# EAGLE design MurataMicroMB (EAGLE 7.5.0)
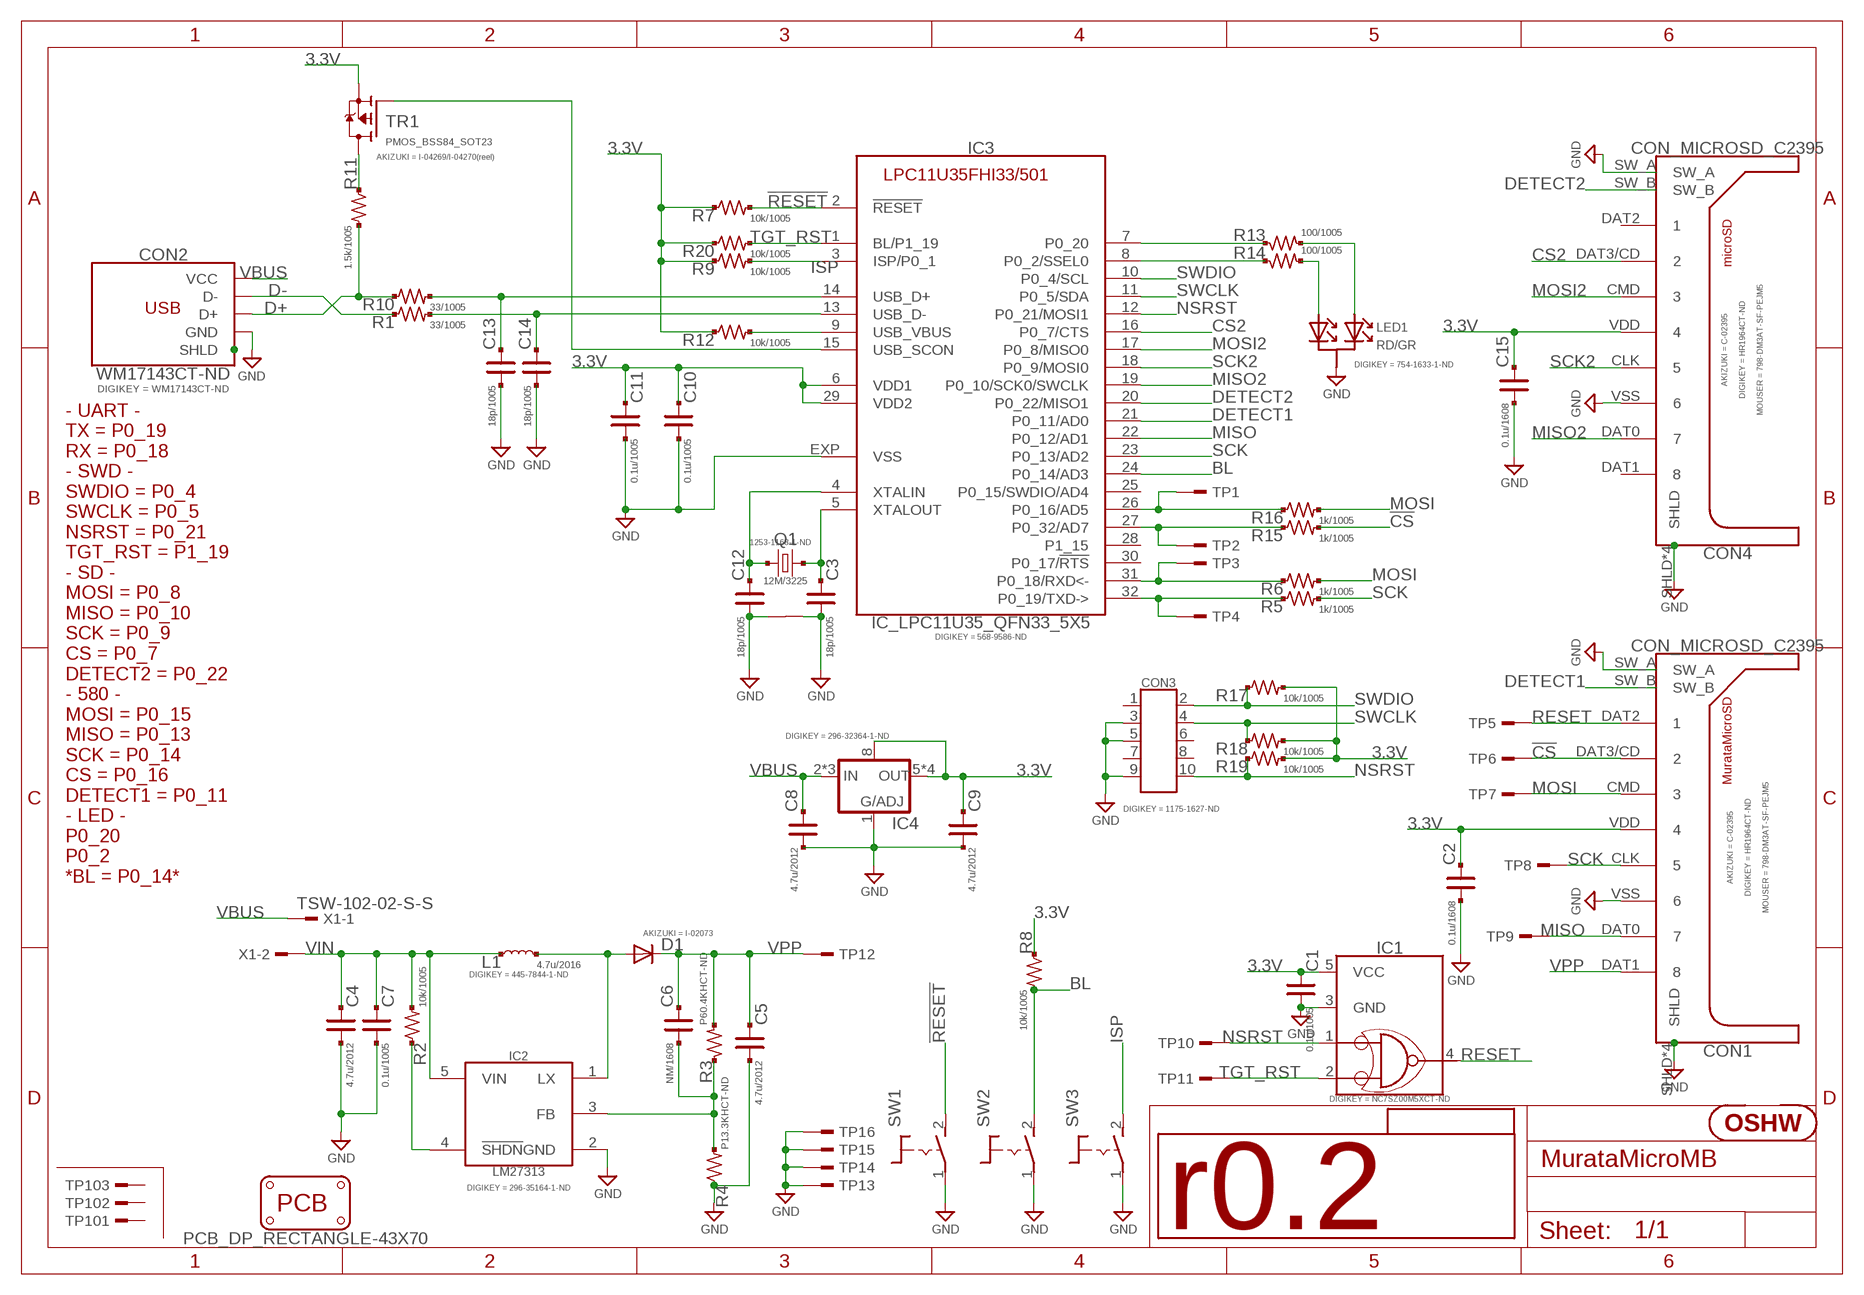
[diagram p0: schematic, sheet 1]

## Parts
C1  0.1u/1005  C_SMD_0.1U_1005  [C0402]
C2  0.1u/1608  C_SMD_0.1U_1608  [CR_1608]
C3  18p/1005  C_SMD_18P_1005  [C0402]
C4  4.7u/2012  C_SMD_4.7U_2012  [CR_2125]
C5  4.7u/2012  C_SMD_4.7U_2012  [CR_2125]
C6  NM/1608  C_SMD__1608  [CR_1608]
C7  0.1u/1005  C_SMD_0.1U_1005  [C0402]
C8  4.7u/2012  C_SMD_4.7U_2012  [CR_2125]
C9  4.7u/2012  C_SMD_4.7U_2012  [CR_2125]
C10  0.1u/1005  C_SMD_0.1U_1005  [C0402]
C11  0.1u/1005  C_SMD_0.1U_1005  [C0402]
C12  18p/1005  C_SMD_18P_1005  [C0402]
C13  18p/1005  C_SMD_18P_1005  [C0402]
C14  18p/1005  C_SMD_18P_1005  [C0402]
C15  0.1u/1608  C_SMD_0.1U_1608  [CR_1608]
CON1  CON_MICROSD_C2395  [CON_MICROSD_C2395]
CON2  WM17143CT-ND  CON_USB_UB  [CON_USB_47589-0001MOLEX]
CON3  CON_MIL_10_ARM  [CON_CORESIGHT10_1175-1627-ND]
CON4  CON_MICROSD_C2395  [CON_MICROSD_C2395]
D1  40V2A  DIODE2_40V2A_SOD123  [DIODE_2125]
GIT1  GIT-REVISION  [GIT-REVISION]
IC1  IC_TTL_SINGLE_74_00_SOT23  [SOT95P280X145-5N]
IC2  LM27313  IC_DCDC_LM27313_SOT23  [SOT95P280X145-5N]
IC3  IC_LPC11U35_QFN33_5X5  [HVQFN33]
IC4  LDO4_3.3_DRJ  [DFN80P410X410_8N]
ICON1  r0.2  ICON_REVISION_2.0  [ICON_REVISION2.0]
L1  4.7u/2016  INDUCTOR_4.7U_2016  [L_2016]
LED1  RD/GR  LED2_A2K1_GR/RD  [SOT105P300X130-3N]
PCB1  PCB_DP_RECTANGLE-43X70  [DP7043_V1]
Q1  12M/3225  CRYSTAL4_12M_3225  [CLOCK_3225]
R1  33/1005  R_US_33R_1005  [C0402]
R2  10k/1005  R_US_10K_1005  [C0402]
R3  P60.4KHCT-ND  R_US_60.4K_1608  [R_1608_PADPAD]
R4  P13.3KHCT-ND  R_US_13.3K_1608  [R_1608_PADPAD]
R5  1k/1005  R_US_1.0K_1005  [C0402]
R6  1k/1005  R_US_1.0K_1005  [C0402]
R7  10k/1005  R_US_10K_1005  [C0402]
R8  10k/1005  R_US_10K_1005  [C0402]
R9  10k/1005  R_US_10K_1005  [C0402]
R10  33/1005  R_US_33R_1005  [C0402]
R11  1.5k/1005  R_US_1.5K_1005  [C0402]
R12  10k/1005  R_US_10K_1005  [C0402]
R13  100/1005  R_US_100R_1005  [C0402]
R14  100/1005  R_US_100R_1005  [C0402]
R15  1k/1005  R_US_1.0K_1005  [C0402]
R16  1k/1005  R_US_1.0K_1005  [C0402]
R17  10k/1005  R_US_10K_1005  [C0402]
R18  10k/1005  R_US_10K_1005  [C0402]
R19  10k/1005  R_US_10K_1005  [C0402]
R20  10k/1005  R_US_10K_1005  [C0402]
SW1  TACTSW2_FSM2JMTR  [SW_TACTSW_FSM2JMTR]
SW2  TACTSW2_FSM2JMTR  [SW_TACTSW_FSM2JMTR]
SW3  TACTSW2_FSM2JMTR  [SW_TACTSW_FSM2JMTR]
TP1  TESTPAD_1608  [TP_1608]
TP2  TESTPAD_1608  [TP_1608]
TP3  TESTPAD_1608  [TP_1608]
TP4  TESTPAD_1608  [TP_1608]
TP5  TESTPAD  [TP06RECT]
TP6  TESTPAD  [TP06RECT]
TP7  TESTPAD  [TP06RECT]
TP8  TESTPAD  [TP06RECT]
TP9  TESTPAD  [TP06RECT]
TP10  TESTPAD  [TP06RECT]
TP11  TESTPAD  [TP06RECT]
TP12  TESTPAD  [TP06RECT]
TP13  TESTPAD_4020  [TP_4020]
TP14  TESTPAD_4020  [TP_4020]
TP15  TESTPAD_4020  [TP_4020]
TP16  TESTPAD_4020  [TP_4020]
TP101  TESTPAD_F  [FIDUCIAL]
TP102  TESTPAD_F  [FIDUCIAL]
TP103  TESTPAD_F  [FIDUCIAL]
TR1  PMOS_BSS84_SOT23  [SOT95P300X140-3N]
U$1  ICON_OSHW  [ICON_OSHW]
X1  TSW-102-02-S-S  [TSW-102-02-S-S]

## Nets
3.3V: C1.1 C2.1 C9.1 C10.1 C11.1 C15.1 CON1.VDD CON4.VDD IC1.5(VCC) IC3.6(VDD1) IC3.29(VDD2) IC4.5(OUT) IC4.6(OUT) IC4.7(OUT) IC4.8(OUT/EN/NC) IC4.EP(OUT) R7.1 R8.1 R9.1 R12.1 R17.2 R18.2 R19.2 R20.1 TR1.2(S)
!CS!: CON1.DAT3/CD R15.2 TP6.TP
!RESET!: IC3.2(!RESET!) R7.2 SW1.2(S)
BL: IC3.24(P0_14/AD3) R8.2 SW2.2(S)
CS2: CON4.DAT3/CD IC3.16(P0_7/CTS)
D+: CON2.3(D+) R10.1 R11.2
D-: CON2.2(D-) R1.1
DETECT1: CON1.SW_B IC3.21(P0_11/AD0)
DETECT2: CON4.SW_B IC3.20(P0_22/MISO1)
GND: C1.2 C2.2 C3.2 C4.2 C5.2 C7.2 C8.2 C9.2 C10.2 C11.2 C12.2 C13.2 C14.2 C15.2 CON1.SHLD CON1.SHLD@2(SHLD) CON1.SHLD@3(SHLD) CON1.SHLD@4(SHLD) CON1.SW_A CON1.VSS CON2.5(GND) CON3.3 CON3.5 CON3.9 CON4.SHLD CON4.SHLD@2(SHLD) CON4.SHLD@3(SHLD) CON4.SHLD@4(SHLD) CON4.SW_A CON4.VSS IC1.3(GND) IC2.2(GND) IC3.EXP(VSS) IC4.1(ADJ) LED1.3(K1) Q1.2 Q1.4 R4.1 SW1.1(P) SW2.1(P) SW3.1(P) TP13.TP TP14.TP TP15.TP TP16.TP
ISP: IC3.3(ISP/P0_1) R9.2 SW3.2(S)
MISO: CON1.DAT0 IC3.22(P0_12/AD1) TP9.TP
MISO2: CON4.DAT0 IC3.19(P0_10/SCK0/SWCLK)
MOSI: CON1.CMD R6.2 R16.2 TP7.TP
MOSI2: CON4.CMD IC3.17(P0_8/MISO0)
N$1: IC3.8(P0_2/SSEL0) R14.1
N$2: R11.1 TR1.3(D)
N$4: CON2.SHD$1(SHLD) CON2.SHD$2(SHLD) CON2.SHD$3(SHLD) CON2.SHD$4(SHLD) CON2.SHD$5(SHLD) CON2.SHD$6(SHLD) CON2.SHD$7(SHLD) CON2.SHD(SHLD)
N$5: C12.1 IC3.4(XTALIN) Q1.1
N$6: IC3.31(P0_18/RXD<-) R6.1 TP3.TP
N$7: D1.A IC2.1(LX) L1.2
N$8: IC2.4(!SHDN!) R2.1
N$9: IC3.32(P0_19/TXD->) R5.1 TP4.TP
N$10: C6.2 IC2.3(FB) R3.1 R4.2
N$11: C3.1 IC3.5(XTALOUT) Q1.3
N$12: IC3.15(USB_SCON) TR1.1(G)
N$13: IC3.9(USB_VBUS) R12.2
N$14: IC3.7(P0_20) R13.1
N$15: LED1.2(A2) R13.2
N$16: LED1.1(A1) R14.2
N$17: IC3.26(P0_16/AD5) R16.1 TP1.TP
N$18: IC3.27(P0_32/AD7) R15.1 TP2.TP
N$20: C13.1 IC3.14(USB_D+) R10.2
N$24: C14.1 IC3.13(USB_D-) R1.2
NSRST: CON3.10 IC1.1(1A) IC3.12(P0_21/MOSI1) R19.1 TP10.TP
RESET: CON1.DAT2 IC1.4(1Y) TP5.TP
SCK: CON1.CLK IC3.23(P0_13/AD2) R5.2 TP8.TP
SCK2: CON4.CLK IC3.18(P0_9/MOSI0)
SWCLK: CON3.4 IC3.11(P0_5/SDA) R18.1
SWDIO: CON3.2 IC3.10(P0_4/SCL) R17.1
TGT_RST: IC1.2(1B) IC3.1(BL/P1_19) R20.2 TP11.TP
VBUS: C8.1 CON2.1(VCC) IC4.2(IN) IC4.3(IN) IC4.4(IN) X1.1
VIN: C4.1 C7.1 IC2.5(VIN) L1.1 R2.2 X1.2
VPP: C5.1 C6.1 CON1.DAT1 D1.K(C) R3.2 TP12.TP
Unconnected: CON3.1 CON3.6 CON3.7 CON3.8 CON4.DAT1 CON4.DAT2 IC3.25(P0_15/SWDIO/AD4) IC3.28(P1_15) IC3.30(P0_17/!RTS!) TP101.TP TP102.TP TP103.TP

## Notes on the sheet
- microSD
- MurataMicroSD
- - UART -
  TX = P0_19
  RX = P0_18
  - SWD -
  SWDIO = P0_4
  SWCLK = P0_5
  NSRST = P0_21
  TGT_RST = P1_19
  - SD -
  MOSI = P0_8
  MISO = P0_10
  SCK = P0_9
  CS = P0_7
  DETECT2 = P0_22
  - 580 -
  MOSI = P0_15
  MISO = P0_13
  SCK = P0_14
  CS = P0_16
  DETECT1 = P0_11
  - LED -
  P0_20
  P0_2
  *BL = P0_14*

## Library data of the parts
C1 C7 C10 C11 = mylib:C_SMD_*: SMD CAPACITOR; DIGIKEY: 490-3261-1-ND; SEEED: 302010024
C2 C15 = mylib:C_SMD_*: SMD CAPACITOR; AKIZUKI: P-05650
C3 C12-C14 = mylib:C_SMD_*: SMD CAPACITOR; DIGIKEY: 490-5858-1-ND; SEEED: 302010016
C4 C5 C8 C9 = mylib:C_SMD_*: SMD CAPACITOR; DIGIKEY: 490-9962-1-ND
C6 = mylib:C_SMD_*: SMD CAPACITOR; NOT_COMPONENT: YES
CON1 CON4 = mylib:CON_MICROSD: HIROSE DM3AT-SF-PEJM5 798-DM3AT-SF-PEJM5(Mouser) http://www.mouser.jp/ProductDetail/Hirose-Connector/DM3AT-SF-PEJM5/?qs=LZSZKJVF%252b2WTDKp%252bR7IYAQ%3d%3d&_cdc=0; AKIZUKI: C-02395; DIGIKEY: HR1964CT-ND; MOUSER: 798-DM3AT-SF-PEJM5
CON2 = mylib:CON_USB: USB B CONNECTOR; DIGIKEY: WM17143CT-ND
CON3 = mylib:CON_MIL_10: MIL Box Pinheader : 10Pin; DIGIKEY: 1175-1627-ND
D1 = mylib:DIODE2_*: DIODE high speed (Philips); AKIZUKI: I-02073; DIGIKEY: SS24FLCT-ND
GIT1 = git-revision:GIT-REVISION; NOT_COMPONENT: YES
IC1 = mylib:IC_TTL_SINGLE_74_00: SINGLE 2-INPUT POSITIVE-OR GATE; DIGIKEY: NC7SZ00M5XCT-ND
IC2 = mylib:IC_DCDC_LM27313; DIGIKEY: 296-35164-1-ND
IC3 = mylib:IC_LPC11U*_QFN33; DIGIKEY: 568-9586-ND; SEEED: 310010053
IC4 = mylib:LDO4_*: LDO with 4 pins; DIGIKEY: 296-32364-1-ND
ICON1 = mylib:ICON_REVISION; NOT_COMPONENT: YES
L1 = mylib:INDUCTOR_; DIGIKEY: 445-7844-1-ND
LED1 = mylib:LED2_A2K1_*; DIGIKEY: 754-1633-1-ND
PCB1 = dp_pcb_local:PCB_DP_RECTANGLE: Dangerous Prototypes Standard Rectangular PCB sizes; NOT_COMPONENT: YES
Q1 = mylib:CRYSTAL4_*: Crystal 4 pins; DIGIKEY: 1253-1168-1-ND
R1 R10 = mylib:R_US_*: SMD resistor Packages : _1608 : 1.6 x 0.8 mm _2125 : 2.0 x 1.25 mm _3216 : 3.2 x 1.6 mm; DIGIKEY: P33.0LCT-ND; SEEED: 301010609
R2 R7-R9 R12 R17-R20 = mylib:R_US_*: SMD resistor Packages : _1608 : 1.6 x 0.8 mm _2125 : 2.0 x 1.25 mm _3216 : 3.2 x 1.6 mm; DIGIKEY: P10.0KLCT-ND; SEEED: 301010047
R3 = mylib:R_US_*: SMD resistor Packages : _1608 : 1.6 x 0.8 mm _2125 : 2.0 x 1.25 mm _3216 : 3.2 x 1.6 mm; DIGIKEY: P60.4KHCT-ND
R4 = mylib:R_US_*: SMD resistor Packages : _1608 : 1.6 x 0.8 mm _2125 : 2.0 x 1.25 mm _3216 : 3.2 x 1.6 mm; DIGIKEY: P13.3KHCT-ND
R5 R6 R15 R16 = mylib:R_US_*: SMD resistor Packages : _1608 : 1.6 x 0.8 mm _2125 : 2.0 x 1.25 mm _3216 : 3.2 x 1.6 mm; DIGIKEY: P1.00KLCT-ND; SEEED: 301010006
R11 = mylib:R_US_*: SMD resistor Packages : _1608 : 1.6 x 0.8 mm _2125 : 2.0 x 1.25 mm _3216 : 3.2 x 1.6 mm; DIGIKEY: P1.50KLCT-ND; SEEED: 301010001
R13 R14 = mylib:R_US_*: SMD resistor Packages : _1608 : 1.6 x 0.8 mm _2125 : 2.0 x 1.25 mm _3216 : 3.2 x 1.6 mm; DIGIKEY: P100LCT-ND; SEEED: 301010028
SW1-SW3 = mylib:TACTSW2_*: 2P tact switch; DIGIKEY: 450-2146-1-ND
TP1-TP4 = mylib:TESTPAD: test points; DIGIKEY: A106145CT-ND
TP5-TP12 TP101-TP103 = mylib:TESTPAD: test points; NOT_COMPONENT: YES
TP13-TP16 = mylib:TESTPAD: test points; DIGIKEY: 36-5019CT-ND
TR1 = mylib:PMOS_*; AKIZUKI: I-04269/I-04270(reel); DIGIKEY: BSS84CT-ND
U$1 = mylib:ICON_OSHW: Silk icon of OSHW; NOT_COMPONENT: YES
X1 = con-samtec.local:TSW-102-02-S-S: THROUGH-HOLE POST HEADER Source: Samtec TSW.pdf; DIGIKEY: S1011EC-02-ND; SEEED: 320020016

## Board
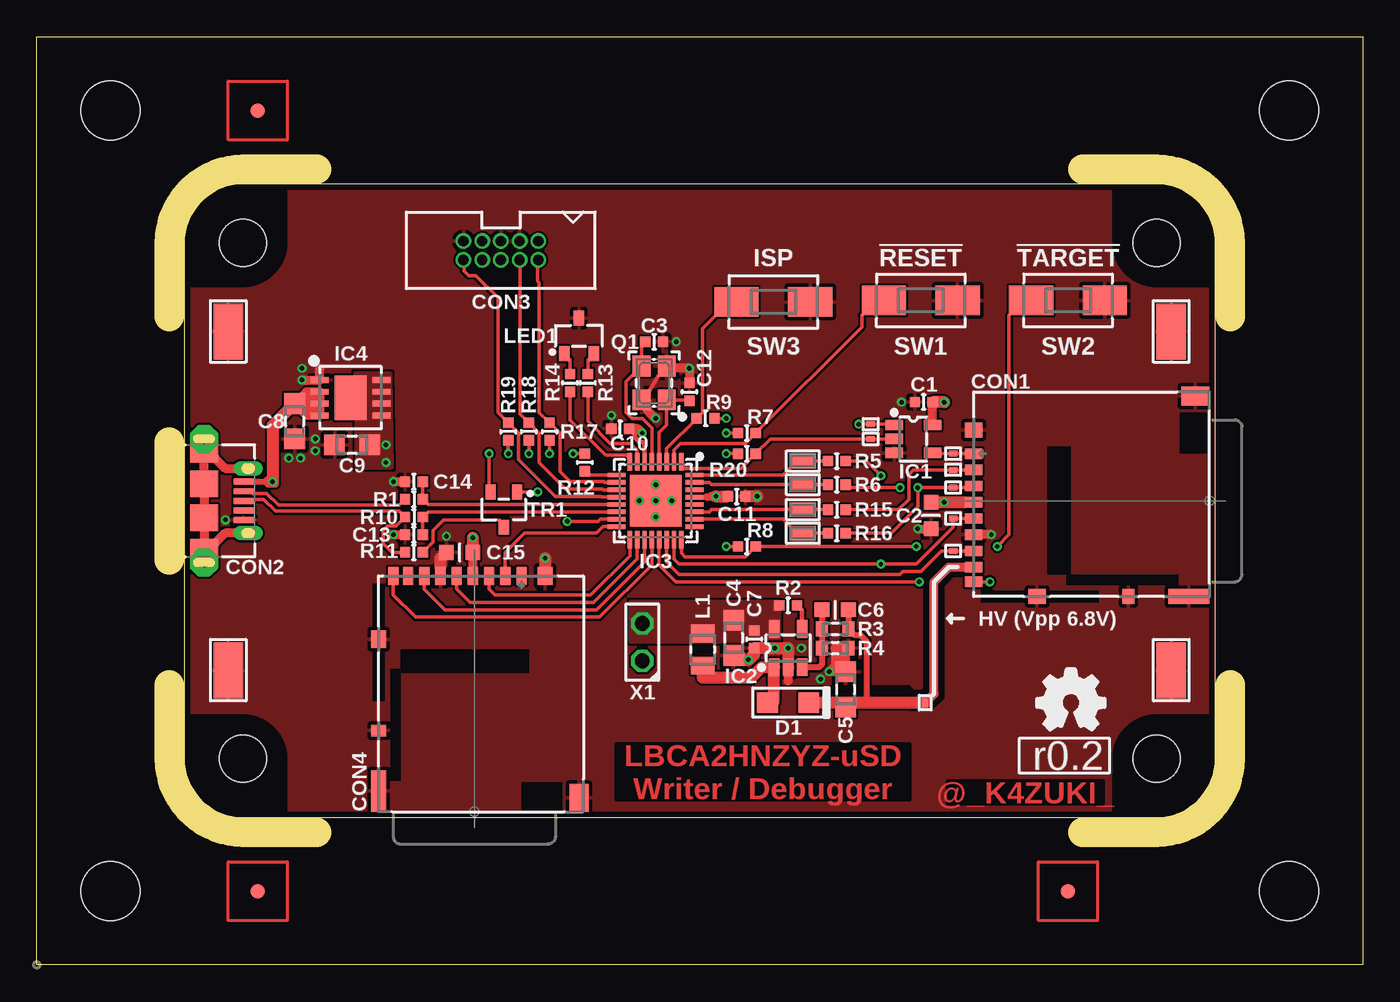
[diagram p1: board, top side]
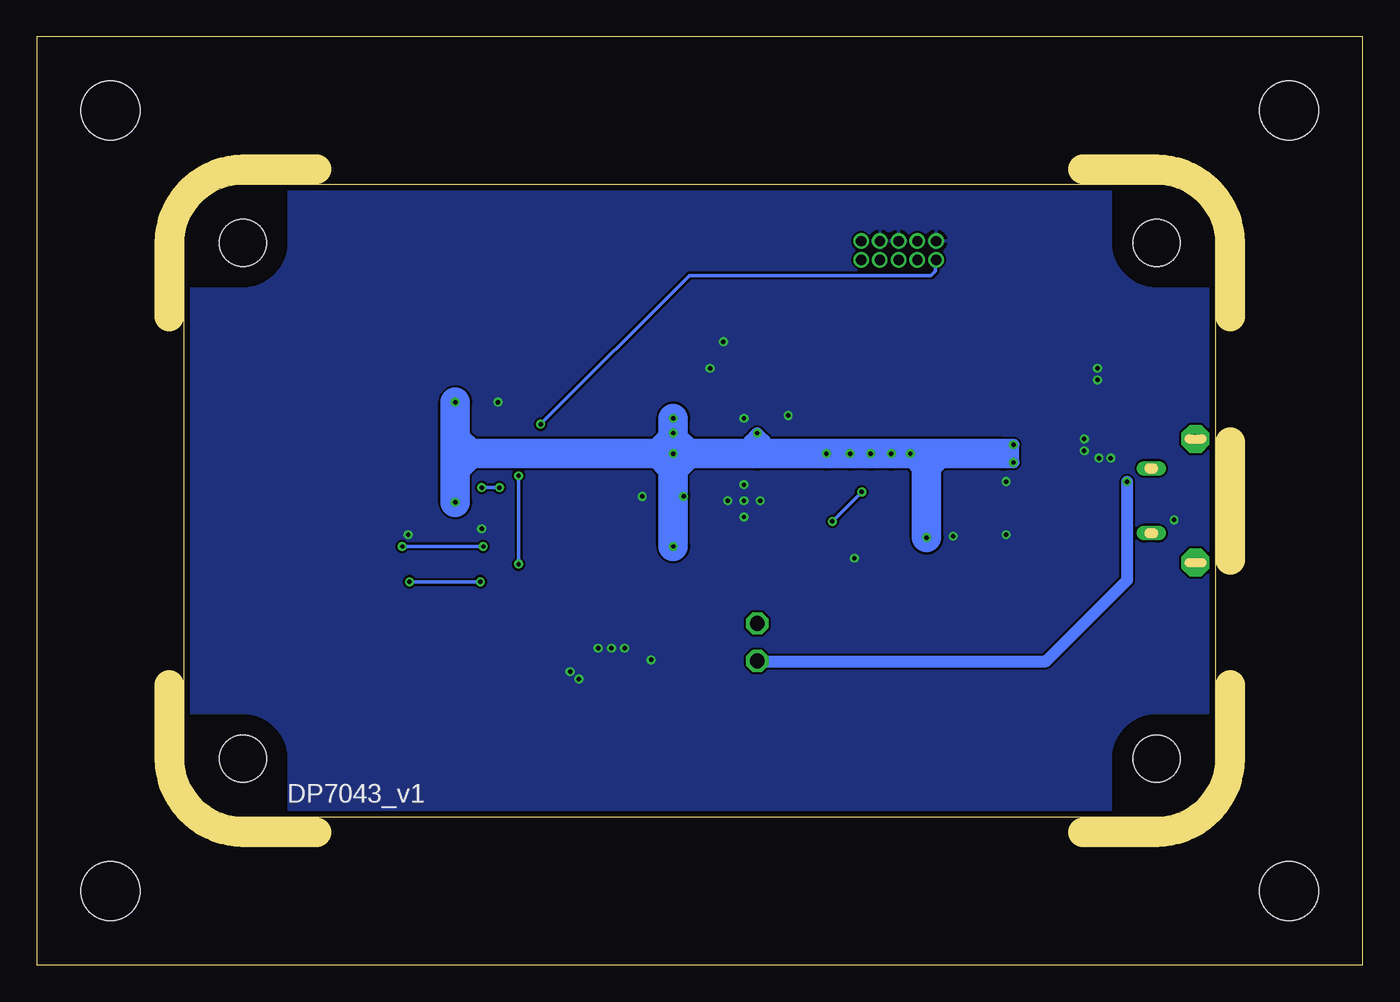
[diagram p2: board, bottom side, seen from below]

Size 90 x 63 mm. Coordinates in mm from the lower left corner, seen from the top.
Outline: 0,63 90,63 90,0 0,0 0,63
Copper layers (1*16): Top 0.035mm / dielectric 1.5mm / Bottom 0.035mm
Design rules "default *": minimum track width 0.15mm, minimum drill 0.3mm, track to track 0.15mm, track to pad 0.15mm, pad to pad 0.15mm, via to via 0.15mm, smd to smd 0mil, copper to edge 0.4mm, drill to drill 8mil, minimum pad ring 0.15mm, minimum via ring 0.15mm, stop-mask expansion 0.05mm, vias tented up to drill 100mil, thermal gap 10mil
Holes 4 mm at 5,58 5,5 85,5 85,58
tRestrict: area 40.4,37.6 to 41.7,39.1; area 44.4,21 to 46,21.8; 13 lines
bRestrict: 1 lines
Milling: 13 lines

### Footprints (pad centres in the part's own frame; a part is rotated, then mirrored left to right if it is on the bottom)
C0402 = smd 0.7 x 0.7: 1 -0.6,0; 2 0.6,0
CR_1608 = smd 1 x 1: 1 -0.9,0; 2 0.9,0
CR_2125 = smd 1.4 x 1.4: 1 -1.2,0; 2 1.2,0
CON_MICROSD_C2395 = smd 0.7 x 1.2: CLK -1.2,16; CMD 1,16; DAT0 -3.4,16; DAT1 -4.5,16; DAT2 3.2,16; DAT3/CD 2.1,16; SW_B -5.5,16; VDD -0.1,16; VSS -2.3,16 | smd 1 x 1.2: SHLD -6.5,11.7; SHLD@4 4.8,16 | smd 1 x 2.8: SHLD@2 -6.5,1.4 | smd 1.3 x 1.9: SHLD@3 7.1,0.95 | smd 1 x 0.8: SW_A -6.5,5.5
CON_USB_47589-0001MOLEX = smd 0.4 x 1.4: 1 -1.3,4.15; 2 -0.65,4.15; 3 0,4.15; 4 0.65,4.15; 5 1.3,4.15 | drill 0.6 pad 1 long: SHD -2.2,4.45; SHD$1 2.2,4.45 | drill 0.6 pad 1.9 octagon: SHD$2 -4.2,1.45; SHD$3 4.2,1.45 | smd 1.6 x 1.9: SHD$4 -3.4,1.45; SHD$7 3.4,1.45 | smd 1.8 x 1.9: SHD$5 -1.15,1.45; SHD$6 1.15,1.45
CON_CORESIGHT10_1175-1627-ND = drill 0.7: 1 -2.54,-0.635; 2 -2.54,0.635; 3 -1.27,-0.635; 4 -1.27,0.635; 5 0,-0.635; 6 0,0.635; 7 1.27,-0.635; 8 1.27,0.635; 9 2.54,-0.635; 10 2.54,0.635
DIODE_2125 = smd 1.4 x 1.4: A 1.4,0; K -1.4,0
SOT95P280X145-5N = smd 1.2 x 0.7: 1 -1.3,0.95; 2 -1.3,0; 3 -1.3,-0.95; 4 1.3,-0.95; 5 1.3,0.95
HVQFN33 = smd 1.2 x 0.3: 1 -2.65,1.75; 2 -2.65,1.25; 3 -2.65,0.75; 4 -2.65,0.25; 5 -2.65,-0.25; 6 -2.65,-0.75; 7 -2.65,-1.25; 8 -2.65,-1.75; 17 2.65,-1.75; 18 2.65,-1.25; 19 2.65,-0.75; 20 2.65,-0.25; 21 2.65,0.25; 22 2.65,0.75; 23 2.65,1.25; 24 2.65,1.75 | smd 0.3 x 1.2: 9 -1.75,-2.65; 10 -1.25,-2.65; 11 -0.75,-2.65; 12 -0.25,-2.65; 13 0.25,-2.65; 14 0.75,-2.65; 15 1.25,-2.65; 16 1.75,-2.65; 25 1.75,2.65; 26 1.25,2.65; 27 0.75,2.65; 28 0.25,2.65; 29 -0.25,2.65; 30 -0.75,2.65; 31 -1.25,2.65; 32 -1.75,2.65 | smd 3.5 x 3.5: EXP 0,0
DFN80P410X410_8N = smd 0.4 x 1.2: 1 -1.2,-2.1; 2 -0.4,-2.1; 3 0.4,-2.1; 4 1.2,-2.1; 5 1.2,2.1; 6 0.4,2.1; 7 -0.4,2.1; 8 -1.2,2.1 | smd 3 x 2.2: EP 0,0
L_2016 = smd 1.2 x 1.6: 1 -1.1,0; 2 1.1,0
SOT105P300X130-3N = smd 0.7 x 1: 1 -1,-1.2; 2 1,-1.2; 3 0,1.2
DP7043_V1 = hole 3.2: 4,4; 66,4; 66,39; 4,39
CLOCK_3225 = smd 1.4 x 1.2: 1 -1.15,-0.85; 2 1.15,-0.85; 3 1.15,0.85; 4 -1.15,0.85
R_1608_PADPAD = smd 0.8 x 1: 1 -0.9,0; 2 0.9,0
SW_TACTSW_FSM2JMTR = smd 3 x 2: 1 -2.5,0; 2 2.5,0
TP_1608 = smd 1.8 x 1: TP 0,0
TP06RECT = smd 0.4 x 0.6: TP 0,0
TP_4020 = smd 3.8 x 2: TP 0,0
FIDUCIAL = smd 1 x 1: TP 0,0
SOT95P300X140-3N = smd 0.7 x 1: 1 -0.9,-1.2; 2 0.9,-1.2; 3 0,1.2
TSW-102-02-S-S = drill 1 pad 1.5 octagon: 1 1.27,0; 2 -1.27,0

### Placement (x,y rotation side)
C1  60.2,38.2 180 top
C2  60.7,30.5 270 top
C3  41.9,42.3 0 top
C4  47.3,22.2 270 top
C5  54.9,18.7 90 top
C6  54.2,24.1 180 top
C7  48.7,22.1 270 top
C8  17.5,36.9 270 top
C9  21.4,35.3 180 top
C10  39.6,36.4 180 top
C11  47.5,31.8 0 top
C12  44.3,38.9 90 top
C13  25.6,29.2 180 top
C14  25.6,32.8 180 top
C15  28.7,28 180 top
CON1  79.6,31.5 90 top
CON2  9.9,31.5 270 top
CON3  31.5,48.5 180 top
CON4  29.7,10.4 0 top
D1  51,17.8 180 top
GIT1  0,0 0 top
IC1  59.5,35.7 0 top
IC2  51,21.5 90 top
IC3  42,31.5 270 top
IC4  21.3,38.5 270 top
ICON1  70,14.2 0 top
L1  45.2,21.4 270 top
LED1  36.8,42.7 0 top
PCB1  10,10 0 top
Q1  41.9,39.5 90 top
R1  25.6,31.6 0 top
R2  51,24.4 180 top
R3  54.2,22.8 0 top
R4  54.2,21.5 180 top
R5  54.3,34.2 0 top
R6  54.3,32.6 0 top
R7  48.2,36.1 0 top
R8  48.2,28.4 0 top
R9  45.4,37.1 180 top
R10  25.6,30.4 0 top
R11  25.6,28 180 top
R12  37.2,34.1 270 top
R13  37.4,39.5 90 top
R14  36.2,39.5 90 top
R15  54.3,30.9 0 top
R16  54.3,29.3 0 top
R17  34.8,36.2 270 top
R18  33.4,36.2 270 top
R19  32,36.2 270 top
R20  48.2,34.7 0 top
SW1  60,45.1 180 top
SW2  70,45.1 180 top
SW3  50,45 180 top
TP1  52,29.3 0 top
TP2  52,30.9 0 top
TP3  52,32.6 0 top
TP4  52,34.2 0 top
TP5  62.2,34.7 90 top
TP6  62.2,33.6 90 top
TP7  62.2,32.4 90 top
TP8  62.2,30.3 90 top
TP9  62.2,28.1 90 top
TP10  56.6,36.7 90 top
TP11  56.6,35.7 90 top
TP12  60.3,17.8 180 top
TP13  77,20 90 top
TP14  13,20 90 top
TP15  13,43 90 top
TP16  77,43 90 top
TP101  15,5 0 top
TP102  70,5 0 top
TP103  15,58 0 top
TR1  31.7,30.9 180 top
U$1  70.2,17.8 0 top
X1  41.1,21.9 270 top

### Tracks (layer width: path | path; a pad name or v marks a point on that pad's centre or on a via)
3.3V  (via drill 0.3)
  Top 0.25: R12.1 v36.4,34.7 | R19.2 v32,34.7 | R18.2 v33.4,34.7 | R17.2 v34.8,34.7 | v46.8,28.4 R8.1 | R9.1 v46.8,37.1 | v46.8,36.1 R7.1 | R20.1 v46.8,34.7 | 60.8,36.8 IC1.5 | TR1.2 30.7,32.2 v30.7,34.7
  Top 0.3: IC3.6 41.25,35.35 41.1,35.5 40.9,35.5 40.6,35.8 40.6,36 C10.1 | IC3.29 45.5,31.75
  Top 0.5: 45.8,31.8 45.75,31.75 45.5,31.75
  Top 0.6: CON1.VDD 63,31.4 | 45.8,31.8 v46.1,31.8 | v41.1,36.1 40.8,36.4 C10.1 | 60.8,36.8 C1.1 | CON4.VDD C15.1
  Top 0.8: 63,31.4 v61.6,31.4 C2.1 | v61.6,38.2 C1.1 | C15.1 v29.6,29 | v46.1,31.8 C11.1
  Bottom 0.25: v46.1,31.8 46.8,31.8
  Bottom 0.8: v23.7,34.1 v23.7,35.3 | v23.7,35.3 24.4,34.7 v23.7,34.1 | v41.1,36.1 41.1,34.7 | v41.1,36.1 41.6,35.6 40.6,35.6 v41.1,36.1 | v23.7,35.3 24.4,35.3 | v23.7,34.1 24.4,34.1
  Bottom 2: 24.4,34.7 28.8,34.7 | 28.8,34.7 29.6,34.7 | 29.6,34.7 30.4,34.7 | 30.4,34.7 v30.7,34.7 v32,34.7 v33.4,34.7 v34.8,34.7 v36.4,34.7 41.1,34.7 45.8,34.7 | 45.8,34.7 v46.8,34.7 | v46.8,34.7 46.8,33.7 | v61.6,31.4 61.6,33.7 | 61.6,33.7 61.6,34.7 | 61.6,34.7 61.6,35.7 | 61.6,35.7 v61.6,38.2 | v46.8,34.7 47.8,34.7 | 47.8,34.7 60.6,34.7 | 60.6,34.7 61.6,34.7 | v29.6,29 29.6,33.9 | 29.6,33.9 29.6,34.7 | 28.8,34.7 29.6,33.9 | 29.6,33.9 30.4,34.7 | v46.8,28.4 46.8,31.8 46.8,33.7 | v46.8,34.7 46.8,35.7 | 46.8,35.7 v46.8,36.1 v46.8,37.1 | 60.6,34.7 61.6,35.7 | 60.6,34.7 61.6,33.7 | 45.8,34.7 46.8,33.7 | 46.8,33.7 47.8,34.7 | 47.8,34.7 46.8,35.7 | 46.8,35.7 45.8,34.7
  pour Top (no thermals): 21.7,33.7 21.6,40.2 24,40.2 24.1,33.7
!CS!
  Top 0.25: CON1.DAT3/CD TP6.TP 59.5,33.6 59.2,33.3 59.2,31.6 58.5,30.9 R15.2
!RESET!
  Top 0.25: IC3.2 43.25,34.95 43.7,35.4 48.1,35.4 R7.2 56,43.3 56,44.1 57,45.1 SW1.2
BL  (via drill 0.3)
  Top 0.25: IC3.24 43.75,27.95 44,27.7 48.1,27.7 R8.2 v59.7,28.4 | SW2.2 67,45.1 66,44.1 66,29.2 v65.2,28.4
  Bottom 0.25: v59.7,28.4 v65.2,28.4
CS2
  Top 0.25: IC3.16 38.45,29.75 38,29.3 33.1,29.3 31.8,28 CON4.DAT3/CD
D+
  Top 0.25: R11.2 24.1,28 23.5,28.6 23.5,29.5 23.8,29.8 24.4,29.8 R10.1 24.6,30.8 16.2,30.8 15.4,31.6 14.7,31.6 14.6,31.5 CON2.3
D-
  Top 0.25: R1.1 24.6,31.2 16.4,31.2 15.6,32 14.7,32 14.55,32.15 CON2.2
DETECT1  (via drill 0.3)
  Top 0.25: CON1.SW_B v64.7,26 | IC3.21 42.25,27.15 43.4,26 v59.9,26
  Bottom 0.25: v64.7,26 v59.9,26
DETECT2
  Top 0.25: CON4.SW_B 24.2,25.1 25.7,23.6 38.2,23.6 41.75,27.15 IC3.20
GND  (via drill 0.3)
  Top 0.25: Q1.2 42.75,40.55 42.2,40 41.6,39 41.05,38.45 Q1.4
  Top 0.6: v59.8,29.6 C2.2 | v64.8,29.2 CON1.VSS | CON4.VSS 27.4,27 | v42,37.1 41.4,37.7 41.4,38.3 41,38.3 | 42.8,40.5 v44.3,40.5 C12.2 | 51,20.9 IC2.2 51,19.3 | v24.2,29.2 C13.2 | v24.2,32.8 C14.2 | v18,39.7 IC4.1 19.2,40.5 | 54.5,19.9 C5.2 54.9,21.3 R4.1 54.5,21.5 | 54.5,19.9 v53.8,19.9 54.2,20.3 54.2,21.5 54.5,21.5 | 54.5,19.9 54.5,21.5
  Top 0.8: 27.4,27 27.4,27.6 C15.2 | v34.5,27.6 CON4.SHLD@4 | v48.9,31.8 C11.2 | 51,20.9 v51,21.5 C7.2 48.7,21.1 v48.3,20.7 48,20.7 47.7,21 C4.2
  other vias: 42,31.5 40.9,31.5 43.1,31.5 42,32.6 42,30.4 43.4,42.3 39,37.3 58.7,38.2 27.8,29.1 12.8,30.2 18.9,35.7 18.9,34.9 17.1,34.4 17.9,34.4 18,40.5 51.9,21.5 50.1,21.5 53.2,19.4
  pour Top (rank 2): 10,53 80,53 80,10 10,10
  pour Bottom: 10,53 80,53 80,10 10,10
ISP
  Top 0.25: IC3.3 42.75,35.05 R9.2 45.2,37.5 45.2,43.2 47,45 SW3.2
MISO
  Top 0.25: CON1.DAT0 TP9.TP 61.4,28.1 60,26.7 58.8,26.7 58.6,26.5 43.6,26.5 42.75,27.35 IC3.22
MISO2
  Top 0.25: IC3.19 41.25,27.35 38,24.1 27.7,24.1 26.3,25.5 CON4.DAT0
MOSI  (via drill 0.3)
  Top 0.25: CON1.CMD 63.2,32.5 63.1,32.4 TP7.TP 60.1,32.4 | 60.1,32.4 v59.8,32.4 59.8,32.1 | R6.2 55.1,32.4 v58.6,32.4 | 59.8,32.1 59.8,31.1 58,29.3 R16.2 | 60.1,32.4 59.8,32.1
  Bottom 0.25: v58.6,32.4 v59.8,32.4
MOSI2
  Top 0.25: IC3.17 40.25,27.75 37.6,25.1 31.1,25.1 30.7,25.5 CON4.CMD
N$1
  Top 0.25: R14.1 36.2,37 38.6,34.6 40,34.6 | 40,34.6 40.25,34.35 IC3.8 | 40,34.6 40.2,34.6
N$2
  Top 0.25: TR1.3 31.7,29.9 31.4,30.2 27.6,30.2 26.9,29.5 26.9,28.7 R11.1
N$4
  Top 0.6: CON2.SHD$2 CON2.SHD$4 | CON2.SHD$7 CON2.SHD$6 CON2.SHD$5 CON2.SHD$4 | CON2.SHD$3 CON2.SHD$7 | CON2.SHD$4 11.6,34.9 12.8,33.7 CON2.SHD | CON2.SHD$1 12.8,29.3 11.6,28.1 CON2.SHD$7
N$5
  Top 0.25: C12.1 44.25,38.35 Q1.1 42.75,36.65 42.25,36.15 IC3.4
N$6
  Top 0.25: IC3.31 45.65,32.75 45.8,32.6 TP3.TP R6.1
N$7
  Top 0.8: L1.2 45.2,19.5 48.5,19.5 49.2,20.2 IC2.1 50,20.2 50,17.8 D1.A
N$8
  Top 0.3: IC2.4 51.95,24.05 R2.1
N$9
  Top 0.25: IC3.32 50.65,33.25 51.6,34.2 TP4.TP R5.1
N$10
  Top 0.4: C6.2 R3.1 R4.2 53.3,20.4 53.1,20.2 IC2.3
N$11
  Top 0.25: IC3.5 41.75,36.45 41.1,37.1 40.4,37.1 40,37.5 40,39.6 Q1.3 41.05,42.05 C3.1
N$12  (via drill 0.3)
  Top 0.25: IC3.15 38.25,30.25 38.1,30.1 v36,30.1 | TR1.1 v34,32.1
  Bottom 0.25: v34,32.1 v36,30.1
N$13
  Top 0.25: IC3.9 37.45,33.25 R12.2
N$14
  Top 0.25: R13.1 37.4,36.9 38.9,35.4 40.3,35.4 40.75,34.95 IC3.7
N$15
  Top 0.25: R13.2 37.4,41.1 LED1.2
N$16
  Top 0.25: R14.2 36.2,41.1 LED1.1
N$17
  Top 0.25: IC3.26 50.65,30.25 51.6,29.3 TP1.TP R16.1
N$18
  Top 0.25: IC3.27 45.65,30.75 45.8,30.9 TP2.TP R15.1
N$20
  Top 0.25: C13.1 R10.2 26.55,30.75 IC3.14
N$24
  Top 0.25: C14.1 R1.2 26.55,31.25 IC3.13
NSRST  (via drill 0.3)
  Top 0.25: IC3.12 38.35,31.75 38.3,31.8 35.2,31.8 32.7,34.3 32.7,36.1 R19.1 31.3,37.5 31.3,45.3 29.8,46.8 29.3,46.8 29,47.1 29,47.6 28.9,47.7 29,47.8 29,47.83 CON3.10 | v55.8,36.7 TP10.TP 58.15,36.7 IC1.1
  Bottom 0.25: CON3.10 29,47.83 29,47.8 28.9,47.7 29,47.6 29,47.1 29.3,46.8 45.7,46.8 v55.8,36.7
RESET
  Top 0.25: CON1.DAT2 TP5.TP 60.85,34.7 IC1.4
SCK  (via drill 0.3)
  Top 0.25: CON1.CLK TP8.TP 62.2,29.7 59.7,27.2 v57.3,27.2 43.6,27.2 43.25,27.55 IC3.23 | R5.2 56.3,34.2 v57.3,33.2
  Bottom 0.25: v57.3,33.2 57.3,27.5 | 57.3,27.5 v57.3,27.2 | 57.3,27.5 57.2,27.4 57.2,27.3 | 57.3,27.5 57.4,27.4 57.4,27.3
SCK2
  Top 0.25: IC3.18 40.75,27.55 37.8,24.6 29.4,24.6 28.5,25.5 CON4.CLK
SWCLK
  Top 0.25: IC3.11 38.45,32.25 38.4,32.3 35.9,32.3 34.1,34.1 34.1,36.1 R18.1 32.8,37.4 32.8,47.8 32.77,47.83 CON3.4
SWDIO
  Top 0.25: IC3.10 38.55,32.75 38.5,32.8 36.2,32.8 35.5,33.5 35.5,36.1 R17.1 34.1,37.5 34.1,46.3 34,46.4 34,47.7 34.1,47.8 CON3.2
TGT_RST
  Top 0.25: IC3.1 43.75,33.95 44,33.7 | 44,33.7 43.8,33.7 | 44,33.7 47.8,33.7 R20.2 49.8,35.7 TP11.TP IC1.2
VBUS  (via drill 0.3)
  Top 0.4: CON2.1 15.5,32.8 | 15.5,32.8 v16,32.8 | 15.5,32.8 15.7,32.6 16,32.6 | 16,32.6 v16,32.8 | 15.5,32.8 15.7,33 16,33 | 16,33 16.2,33 16.2,32.6 16,32.6 | 16,33 v16,32.8
  Top 0.6: 18.8,37.3 IC4.4 IC4.2 18.8,38.9 | 18.8,37.3 18.3,37.3 | 18.3,37.3 C8.1 | IC4.3 C8.1 | 18.8,38.9 18.3,38.9 | 18.3,38.9 C8.1 | 18.8,38.9 18.8,37.3 | 18.3,38.9 18.3,37.3
  Top 0.8: C8.1 16,36.6 v16,32.8
  Bottom 0.8: v16,32.8 16,26.1 21.5,20.6 41.1,20.6 X1.1
VIN
  pour Top (no thermals): 40.3,21.9 40.3,24.7 50.4,24.7 50.4,21.9
VPP
  Top 0.4: C6.1 R3.2 55.5,22.4 55.9,22.4 56.3,22 56.3,17.8
  Top 0.6: TP12.TP 60.9,18.4 60.9,26 61.9,27 CON1.DAT1
  Top 0.8: D1.K 54.9,17.8 | 54.9,17.8 56.3,17.8 TP12.TP | C5.1 54.9,17.8

### Text on the board
Top: LBCA2HNZYZ-uSD / Writer / Debugger | @_K4ZUKI_
tPlace: ISP | !RESET! | !TARGET! | HV (Vpp 6.8V) | board thickness t = 1.2mm
Vscore: V-CUT | V-CUT | V-CUT | V-CUT